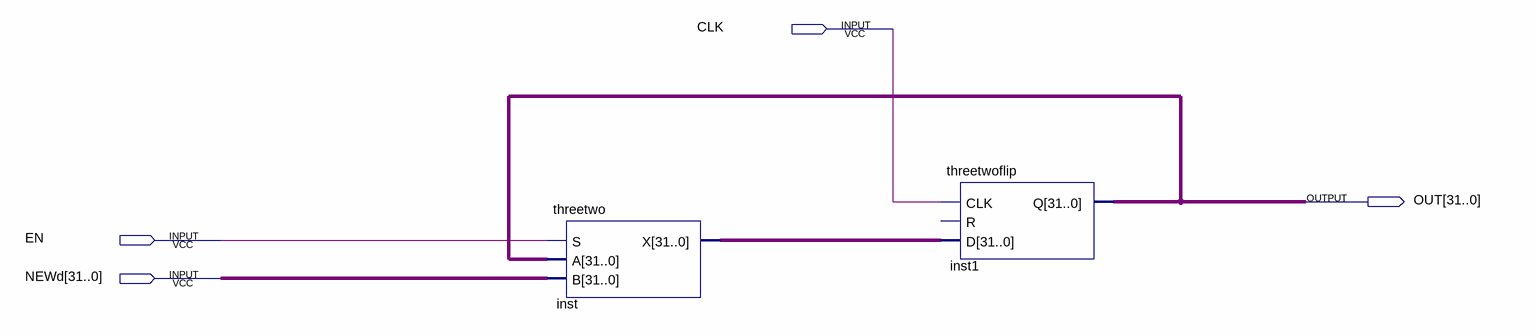
[diagram p0: schematic sheet]
// Quartus schematic threetwoenabledflip.bdf as structural Verilog: 2 symbols, 4 pins
module threetwoenabledflip (
  input  CLK,
  input  EN,
  input  [31:0] NEWd,
  output [31:0] OUT
);

  wire [31:0] inst_x;

  threetwo inst (.S(EN), .A(OUT), .B(NEWd), .X(inst_x));
  threetwoflip inst1 (.CLK(CLK), .D(inst_x), .Q(OUT));  // open: R
endmodule
